# Altium schematic sheet Brduino-MCU-Main.SchDoc: BRDUINO
size A3; Organization: TDK Micronas; DocumentNumber: tbd; Revision: 0.00.001; SheetNumber: 2; SheetTotal: 4; Date: 8/14/2020; DrawnBy: Moerz; Engineer: Moerz
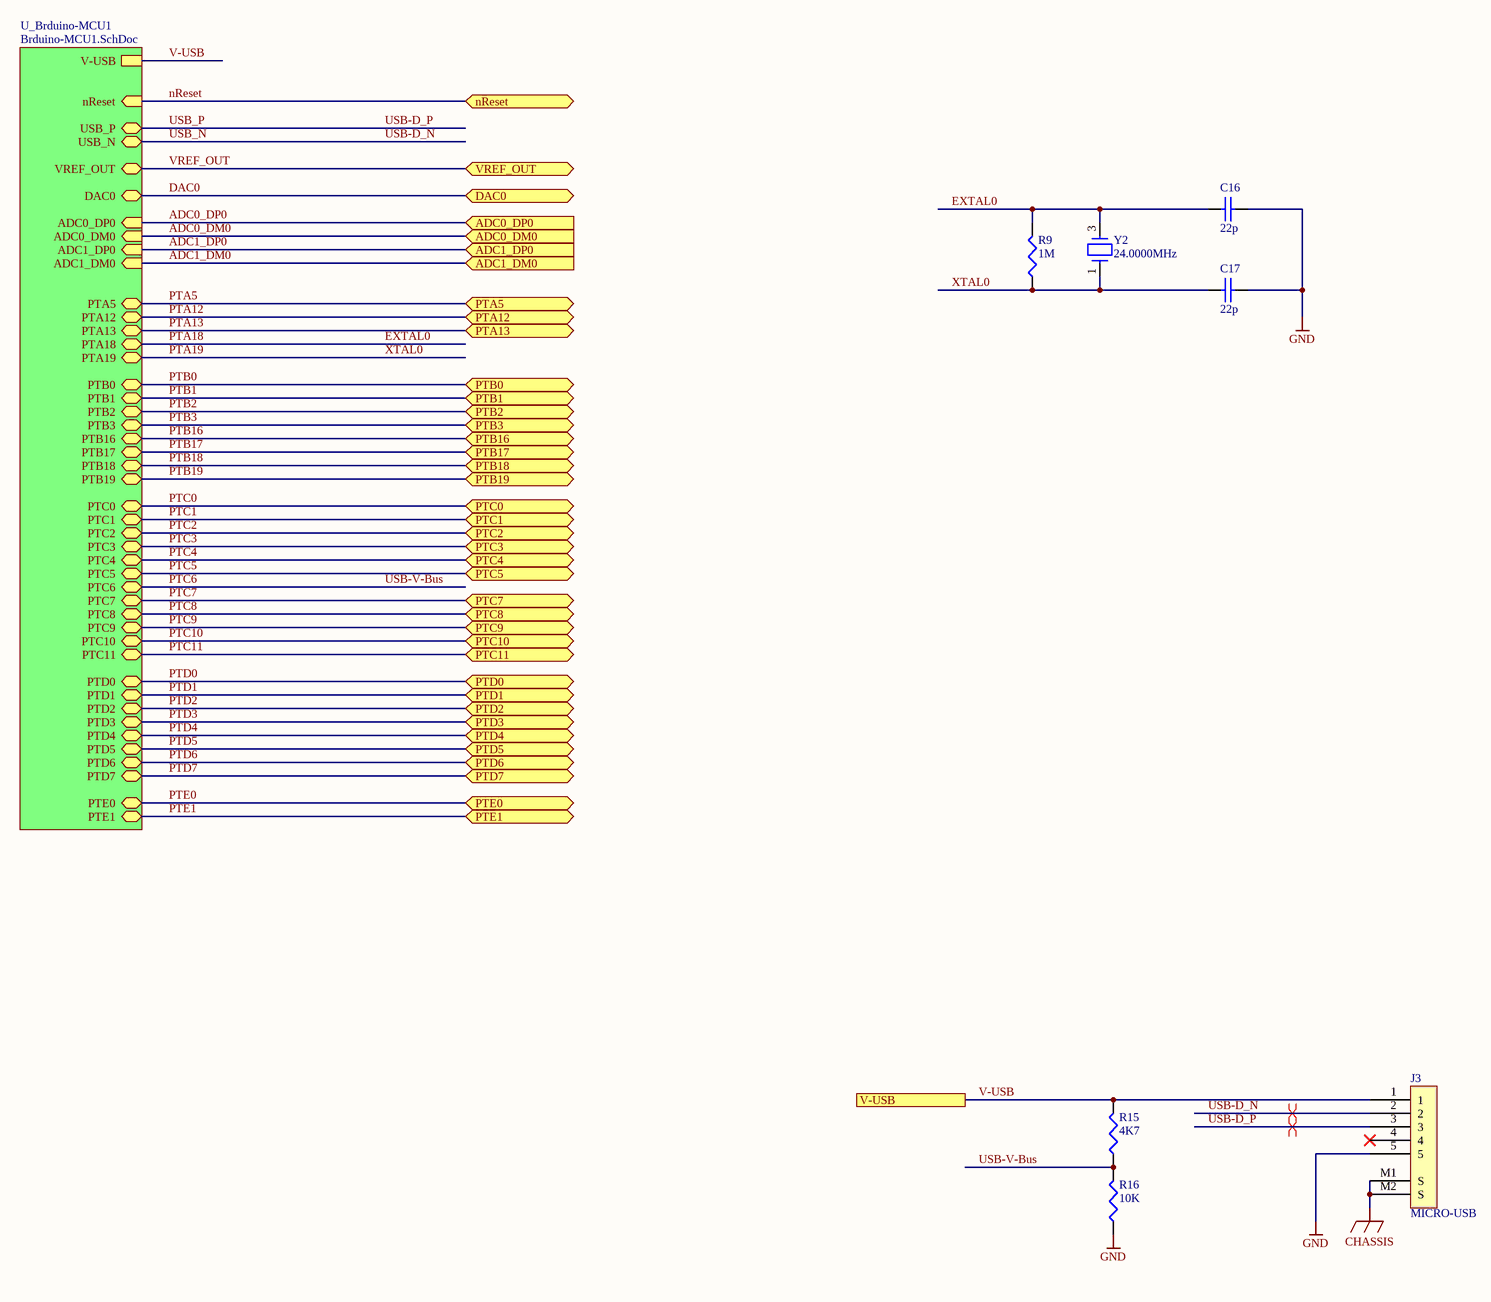
[diagram p0: Brduino-MCU-Main.SchDoc]

## Parts
C16  22p  [C0402]
C17  22p  [C0402]
J3  MICRO-USB  [Molex-0565790519]  (no BOM)
R9  1M  [R0402]
R15  4K7  [R0402]
R16  10K  [R0402]
Y2  24.0000MHz  [EPSON-XTAL6 3.2mm x 5mm 4pin]

## Sub-sheets
U_Brduino-MCU1 = Brduino-MCU1.SchDoc: nReset (in), V-USB, PTE0 (bidir), PTE1 (bidir), PTA5 (bidir), PTA12 (bidir), PTA13 (bidir), PTA18 (bidir), PTA19 (bidir), PTB0 (bidir), PTB1 (bidir), PTB2 (bidir), PTB3 (bidir), PTB16 (bidir), PTB17 (bidir), PTB18 (bidir), PTB19 (bidir), PTC0 (bidir), PTC1 (bidir), PTC2 (bidir), PTC3 (bidir), PTC4 (bidir), PTC5 (bidir), PTC6 (bidir), PTC7 (bidir), PTC8 (bidir), PTC9 (bidir), PTC10 (bidir), PTC11 (bidir), PTD0 (bidir), PTD1 (bidir), PTD2 (bidir), PTD3 (bidir), PTD4 (bidir), PTD5 (bidir), PTD6 (bidir), PTD7 (bidir), ADC0_DP0 (in), ADC0_DM0 (in), ADC1_DP0 (in), ADC1_DM0 (in), VREF_OUT (bidir), DAC0 (bidir), USB_P (bidir), USB_N (bidir)

## Ports
ADC0_DM0 (in), ADC0_DP0 (in), ADC1_DM0 (in), ADC1_DP0 (in), DAC0 (bidir), nReset (bidir), PTA5 (bidir), PTA12 (bidir), PTA13 (bidir), PTB0 (bidir), PTB1 (bidir), PTB2 (bidir), PTB3 (bidir), PTB16 (bidir), PTB17 (bidir), PTB18 (bidir), PTB19 (bidir), PTC0 (bidir), PTC1 (bidir), PTC2 (bidir), PTC3 (bidir), PTC4 (bidir), PTC5 (bidir), PTC7 (bidir), PTC8 (bidir), PTC9 (bidir), PTC10 (bidir), PTC11 (bidir), PTD0 (bidir), PTD1 (bidir), PTD2 (bidir), PTD3 (bidir), PTD4 (bidir), PTD5 (bidir), PTD6 (bidir), PTD7 (bidir), PTE0 (bidir), PTE1 (bidir), V-USB, VREF_OUT (bidir)

## Nets
CHASSIS: J3.M1(S) J3.M2(S)
GND: C16.2 C17.2 J3.5 R16.1
ADC0_DM0: port ADC0_DM0, sheet U_Brduino-MCU1/ADC0_DM0
ADC0_DP0: port ADC0_DP0, sheet U_Brduino-MCU1/ADC0_DP0
ADC1_DM0: port ADC1_DM0, sheet U_Brduino-MCU1/ADC1_DM0
ADC1_DP0: port ADC1_DP0, sheet U_Brduino-MCU1/ADC1_DP0
DAC0: port DAC0, sheet U_Brduino-MCU1/DAC0
EXTAL0: C16.1 R9.2 Y2.3 ; sheet U_Brduino-MCU1/PTA18  [also labelled PTA18]
nReset: port nReset, sheet U_Brduino-MCU1/nReset
PTA5: port PTA5, sheet U_Brduino-MCU1/PTA5
PTA12: port PTA12, sheet U_Brduino-MCU1/PTA12
PTA13: port PTA13, sheet U_Brduino-MCU1/PTA13
PTA19: C17.1 R9.1 Y2.1 ; sheet U_Brduino-MCU1/PTA19  [also labelled XTAL0]
PTB0: port PTB0, sheet U_Brduino-MCU1/PTB0
PTB1: port PTB1, sheet U_Brduino-MCU1/PTB1
PTB2: port PTB2, sheet U_Brduino-MCU1/PTB2
PTB3: port PTB3, sheet U_Brduino-MCU1/PTB3
PTB16: port PTB16, sheet U_Brduino-MCU1/PTB16
PTB17: port PTB17, sheet U_Brduino-MCU1/PTB17
PTB18: port PTB18, sheet U_Brduino-MCU1/PTB18
PTB19: port PTB19, sheet U_Brduino-MCU1/PTB19
PTC0: port PTC0, sheet U_Brduino-MCU1/PTC0
PTC1: port PTC1, sheet U_Brduino-MCU1/PTC1
PTC2: port PTC2, sheet U_Brduino-MCU1/PTC2
PTC3: port PTC3, sheet U_Brduino-MCU1/PTC3
PTC4: port PTC4, sheet U_Brduino-MCU1/PTC4
PTC5: port PTC5, sheet U_Brduino-MCU1/PTC5
PTC6: R15.1 R16.2 ; sheet U_Brduino-MCU1/PTC6  [also labelled USB-V-Bus]
PTC7: port PTC7, sheet U_Brduino-MCU1/PTC7
PTC8: port PTC8, sheet U_Brduino-MCU1/PTC8
PTC9: port PTC9, sheet U_Brduino-MCU1/PTC9
PTC10: port PTC10, sheet U_Brduino-MCU1/PTC10
PTC11: port PTC11, sheet U_Brduino-MCU1/PTC11
PTD0: port PTD0, sheet U_Brduino-MCU1/PTD0
PTD1: port PTD1, sheet U_Brduino-MCU1/PTD1
PTD2: port PTD2, sheet U_Brduino-MCU1/PTD2
PTD3: port PTD3, sheet U_Brduino-MCU1/PTD3
PTD4: port PTD4, sheet U_Brduino-MCU1/PTD4
PTD5: port PTD5, sheet U_Brduino-MCU1/PTD5
PTD6: port PTD6, sheet U_Brduino-MCU1/PTD6
PTD7: port PTD7, sheet U_Brduino-MCU1/PTD7
PTE0: port PTE0, sheet U_Brduino-MCU1/PTE0
PTE1: port PTE1, sheet U_Brduino-MCU1/PTE1
USB-D_N: J3.2 ; sheet U_Brduino-MCU1/USB_N  [also labelled USB_N]
USB-D_P: J3.3 ; sheet U_Brduino-MCU1/USB_P  [also labelled USB_P]
V-USB: J3.1 R15.2 ; port V-USB, sheet U_Brduino-MCU1/V-USB
VREF_OUT: port VREF_OUT, sheet U_Brduino-MCU1/VREF_OUT

Not connected (* = marked no-connect by the designer): J3 4*

## Layout directives
differential pair: USB-D_N, USB-D_P

## Notes on the sheet
- Title
- Size:
- Date:
- A3
- Number:
- Time:
- Revision:
- Sheet
- of
- R
- Schlossstrasse 50
- D-66352 Karlsbrunn
- Germany
- Engineering GmbH
- ev
- ision
- O
- ne
- File:

## Library data of the parts
C16 C17 = CAP: POPULATED: yes; Parameters: C0G, 16V, 5%
J3 = MICRO-USB: MFR-PN: USB3080; MFR: GCT; POPULATED: yes
R9 R15 R16 = RES1A: POPULATED: yes; Parameters: 1/16W, 50V, 1%
Y2 = CRYSTAL-5X3.2: MFR: EPSON; MFR-PN: FA-238 24.0000MB-C; Parameters: -20°C/+70°C, 50ppm, 18pF, 60ohms; POPULATED: yes